# Altium schematic sheet BG1094_Connector.SchDoc: =project_title
size Tabloid; CompanyName: Luxonis Holding; Organization: Luxonis Holding; Address1: 1925 Harmony Park Drive; Address2: Westminster, CO; Address3: 80234; Address4: United States; SheetNumber: 3; SheetTotal: 5
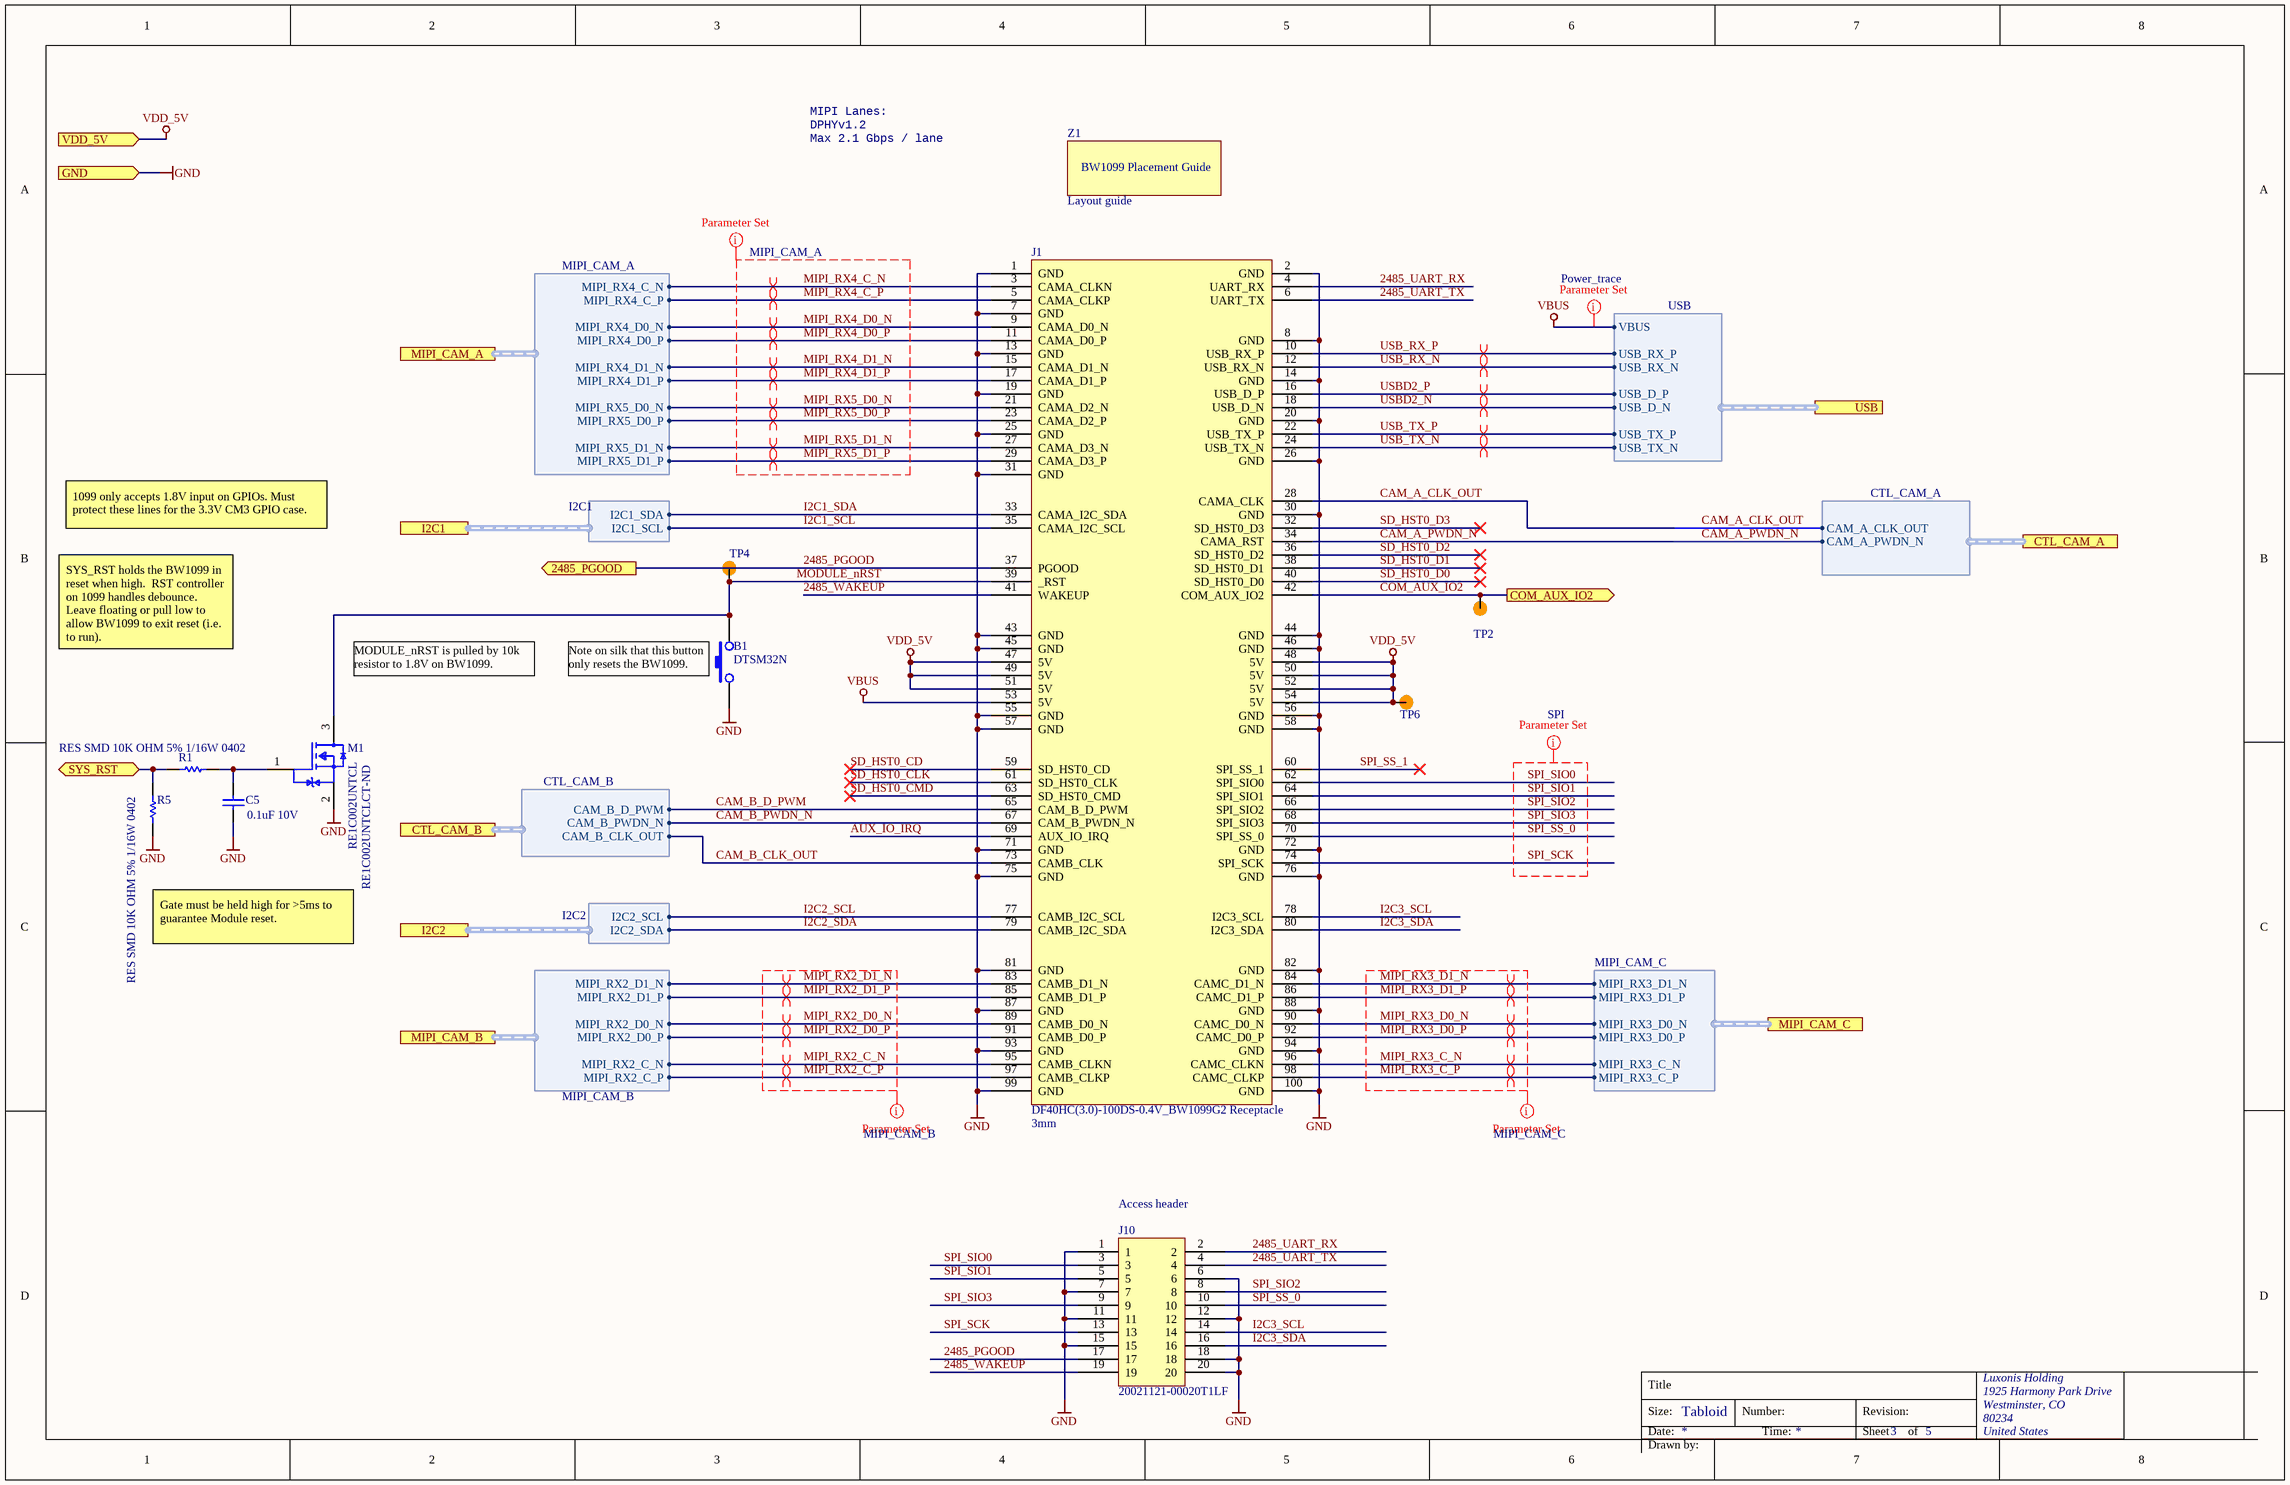
[diagram p0: BG1094_Connector.SchDoc]

## Parts
B1  DTSM32N  [DTSM32N]
C5  0.1uF 10V  [CAPC0402(1005)70_N]
J1  DF40HC(3.0)-100DS-0.4V_BW1099G2 Receptacle  Mated Stacking Height: 3mm  [DF40HC-3.0-100DS-0.4V_minpad]
J10  20021121-00020T1LF  [20021121-00020T1LF]
M1  RE1C002UNTCL  Supplier Part Number 1: RE1C002UNTCLCT-ND  [SOT-416FL]
R1  RES SMD 10K OHM 5% 1/16W 0402  [RESC0402(1005)_N]
R5  RES SMD 10K OHM 5% 1/16W 0402  [RESC0402(1005)_N]
TP2  TP100_200_NS  [TP100_200_NS]  (value not drawn)  (no BOM)
TP4  TP_SMD  [TP_0.75MM_SMD_NO-SILK]  (value not drawn)  (no BOM)
TP6  TP_SMD  [TP_0.75MM_SMD_NO-SILK]  (value not drawn)  (no BOM)
Z1  Layout guide  [BW1099_Footprint]  (no BOM)

## Ports
2485_PGOOD (out), COM_AUX_IO2 (out), CTL_CAM_A (harness CTL_CAM_A), CTL_CAM_B (harness CTL_CAM_B), GND (in), I2C1 (harness I2C1), I2C2 (harness I2C2), MIPI_CAM_A (harness MIPI_CAM_A), MIPI_CAM_B (harness MIPI_CAM_B), MIPI_CAM_C (harness MIPI_CAM_C), SYS_RST (bidir), USB (harness USB), VDD_5V (in)

## Harnesses
MIPI_CAM_B: MIPI_RX2_C_P, MIPI_RX2_C_N, MIPI_RX2_D0_P, MIPI_RX2_D0_N, MIPI_RX2_D1_P, MIPI_RX2_D1_N
MIPI_CAM_A: MIPI_RX4_C_P, MIPI_RX4_C_N, MIPI_RX4_D0_P, MIPI_RX4_D0_N, MIPI_RX4_D1_P, MIPI_RX4_D1_N, MIPI_RX5_D0_P, MIPI_RX5_D0_N, MIPI_RX5_D1_P, MIPI_RX5_D1_N
MIPI_CAM_C: MIPI_RX3_C_P, MIPI_RX3_C_N, MIPI_RX3_D0_P, MIPI_RX3_D0_N, MIPI_RX3_D1_P, MIPI_RX3_D1_N
I2C2: I2C2_SDA, I2C2_SCL
I2C1: I2C1_SDA, I2C1_SCL
USB: USB_D_P, USB_D_N, USB_TX_N, USB_TX_P, USB_RX_N, USB_RX_P, VBUS
CTL_CAM_A: CAM_A_PWDN_N, CAM_A_CLK_OUT
CTL_CAM_B: CAM_B_CLK_OUT, CAM_B_PWDN_N, CAM_B_D_PWM

## Nets
GND: B1.1 C5.1 J1.1(GND) J1.2(GND) J1.7(GND) J1.8(GND) J1.13(GND) J1.14(GND) J1.19(GND) J1.20(GND) J1.25(GND) J1.26(GND) J1.30(GND) J1.31(GND) J1.43(GND) J1.44(GND) J1.45(GND) J1.46(GND) J1.55(GND) J1.56(GND) J1.57(GND) J1.58(GND) J1.71(GND) J1.72(GND) J1.75(GND) J1.76(GND) J1.81(GND) J1.82(GND) J1.87(GND) J1.88(GND) J1.93(GND) J1.94(GND) J1.99(GND) J1.100(GND) J10.1 J10.6 J10.7 J10.11 J10.12 J10.15 J10.18 J10.20 M1.2(Source) R5.1 ; port GND
VBUS: J1.53(5V) ; port USB.VBUS
VDD_5V: J1.47(5V) J1.48(5V) J1.49(5V) J1.50(5V) J1.51(5V) J1.52(5V) J1.54(5V) TP6.1 ; port VDD_5V
2485_PGOOD: J1.37(PGOOD) J10.17 ; port 2485_PGOOD
2485_UART_RX: J1.4(UART_RX) J10.2
2485_UART_TX: J1.6(UART_TX) J10.4
2485_WAKEUP: J1.41(WAKEUP) J10.19
AUX_IO_IRQ: J1.69(AUX_IO_IRQ)
CAM_A_CLK_OUT: J1.28(CAMA_CLK) ; port CTL_CAM_A.CAM_A_CLK_OUT
CAM_A_PWDN_N: J1.34(CAMA_RST) ; port CTL_CAM_A.CAM_A_PWDN_N
CAM_B_CLK_OUT: J1.73(CAMB_CLK) ; port CTL_CAM_B.CAM_B_CLK_OUT
CAM_B_D_PWM: J1.65(CAM_B_D_PWM) ; port CTL_CAM_B.CAM_B_D_PWM
CAM_B_PWDN_N: J1.67(CAM_B_PWDN_N) ; port CTL_CAM_B.CAM_B_PWDN_N
COM_AUX_IO2: J1.42(COM_AUX_IO2) TP2.1 ; port COM_AUX_IO2
I2C1_SCL: J1.35(CAMA_I2C_SCL) ; port I2C1.I2C1_SCL
I2C1_SDA: J1.33(CAMA_I2C_SDA) ; port I2C1.I2C1_SDA
I2C2_SCL: J1.77(CAMB_I2C_SCL) ; port I2C2.I2C2_SCL
I2C2_SDA: J1.79(CAMB_I2C_SDA) ; port I2C2.I2C2_SDA
I2C3_SCL: J1.78(I2C3_SCL) J10.14
I2C3_SDA: J1.80(I2C3_SDA) J10.16
MIPI_RX2_C_N: J1.95(CAMB_CLKN) ; port MIPI_CAM_B.MIPI_RX2_C_N
MIPI_RX2_C_P: J1.97(CAMB_CLKP) ; port MIPI_CAM_B.MIPI_RX2_C_P
MIPI_RX2_D0_N: J1.89(CAMB_D0_N) ; port MIPI_CAM_B.MIPI_RX2_D0_N
MIPI_RX2_D0_P: J1.91(CAMB_D0_P) ; port MIPI_CAM_B.MIPI_RX2_D0_P
MIPI_RX2_D1_N: J1.83(CAMB_D1_N) ; port MIPI_CAM_B.MIPI_RX2_D1_N
MIPI_RX2_D1_P: J1.85(CAMB_D1_P) ; port MIPI_CAM_B.MIPI_RX2_D1_P
MIPI_RX3_C_N: J1.96(CAMC_CLKN) ; port MIPI_CAM_C.MIPI_RX3_C_N
MIPI_RX3_C_P: J1.98(CAMC_CLKP) ; port MIPI_CAM_C.MIPI_RX3_C_P
MIPI_RX3_D0_N: J1.90(CAMC_D0_N) ; port MIPI_CAM_C.MIPI_RX3_D0_N
MIPI_RX3_D0_P: J1.92(CAMC_D0_P) ; port MIPI_CAM_C.MIPI_RX3_D0_P
MIPI_RX3_D1_N: J1.84(CAMC_D1_N) ; port MIPI_CAM_C.MIPI_RX3_D1_N
MIPI_RX3_D1_P: J1.86(CAMC_D1_P) ; port MIPI_CAM_C.MIPI_RX3_D1_P
MIPI_RX4_C_N: J1.3(CAMA_CLKN) ; port MIPI_CAM_A.MIPI_RX4_C_N
MIPI_RX4_C_P: J1.5(CAMA_CLKP) ; port MIPI_CAM_A.MIPI_RX4_C_P
MIPI_RX4_D0_N: J1.9(CAMA_D0_N) ; port MIPI_CAM_A.MIPI_RX4_D0_N
MIPI_RX4_D0_P: J1.11(CAMA_D0_P) ; port MIPI_CAM_A.MIPI_RX4_D0_P
MIPI_RX4_D1_N: J1.15(CAMA_D1_N) ; port MIPI_CAM_A.MIPI_RX4_D1_N
MIPI_RX4_D1_P: J1.17(CAMA_D1_P) ; port MIPI_CAM_A.MIPI_RX4_D1_P
MIPI_RX5_D0_N: J1.21(CAMA_D2_N) ; port MIPI_CAM_A.MIPI_RX5_D0_N
MIPI_RX5_D0_P: J1.23(CAMA_D2_P) ; port MIPI_CAM_A.MIPI_RX5_D0_P
MIPI_RX5_D1_N: J1.27(CAMA_D3_N) ; port MIPI_CAM_A.MIPI_RX5_D1_N
MIPI_RX5_D1_P: J1.29(CAMA_D3_P) ; port MIPI_CAM_A.MIPI_RX5_D1_P
MODULE_nRST: B1.2 J1.39(_RST) M1.3(Drain) TP4.1
SD_HST0_CD: J1.59(SD_HST0_CD)
SD_HST0_CLK: J1.61(SD_HST0_CLK)
SD_HST0_CMD: J1.63(SD_HST0_CMD)
SD_HST0_D0: J1.40(SD_HST0_D0)
SD_HST0_D1: J1.38(SD_HST0_D1)
SD_HST0_D2: J1.36(SD_HST0_D2)
SD_HST0_D3: J1.32(SD_HST0_D3)
SPI_SCK: J1.74(SPI_SCK) J10.13
SPI_SIO0: J1.62(SPI_SIO0) J10.3
SPI_SIO1: J1.64(SPI_SIO1) J10.5
SPI_SIO2: J1.66(SPI_SIO2) J10.8
SPI_SIO3: J1.68(SPI_SIO3) J10.9
SPI_SS_0: J1.70(SPI_SS_0) J10.10
SPI_SS_1: J1.60(SPI_SS_1)
SYS_RST: R1.2 R5.2 ; port SYS_RST
USB_RX_N: J1.12(USB_RX_N) ; port USB.USB_RX_N
USB_RX_P: J1.10(USB_RX_P) ; port USB.USB_RX_P
USB_TX_N: J1.24(USB_TX_N) ; port USB.USB_TX_N
USB_TX_P: J1.22(USB_TX_P) ; port USB.USB_TX_P
USBD2_N: J1.18(USB_D_N) ; port USB.USB_D_N
USBD2_P: J1.16(USB_D_P) ; port USB.USB_D_P
NetC5_2: C5.2 M1.1(Gate) R1.1

## Layout directives
net class MIPI_CAM_C; rule Matched Net Lengths [Tolerance = 5mil]: MIPI_RX3_C_N, MIPI_RX3_C_P, MIPI_RX3_D0_N, MIPI_RX3_D0_P, MIPI_RX3_D1_N, MIPI_RX3_D1_P
net class MIPI_CAM_A; rule Matched Net Lengths [Tolerance = 5mil]: MIPI_RX4_C_N, MIPI_RX4_C_P, MIPI_RX4_D0_N, MIPI_RX4_D0_P, MIPI_RX4_D1_N, MIPI_RX4_D1_P, MIPI_RX5_D0_N, MIPI_RX5_D0_P, MIPI_RX5_D1_N, MIPI_RX5_D1_P
net class MIPI_CAM_B; rule Matched Net Lengths [Tolerance = 5mil]: MIPI_RX2_C_N, MIPI_RX2_C_P, MIPI_RX2_D0_N, MIPI_RX2_D0_P, MIPI_RX2_D1_N, MIPI_RX2_D1_P
differential pair; differential pair class 100ohm: MIPI_RX2_C_N, MIPI_RX2_C_P, MIPI_RX2_D0_N, MIPI_RX2_D0_P, MIPI_RX2_D1_N, MIPI_RX2_D1_P, MIPI_RX3_C_N, MIPI_RX3_C_P, MIPI_RX3_D0_N, MIPI_RX3_D0_P, MIPI_RX3_D1_N, MIPI_RX3_D1_P, MIPI_RX4_C_N, MIPI_RX4_C_P, MIPI_RX4_D0_N, MIPI_RX4_D0_P, MIPI_RX4_D1_N, MIPI_RX4_D1_P, MIPI_RX5_D0_N, MIPI_RX5_D0_P, MIPI_RX5_D1_N, MIPI_RX5_D1_P
differential pair; differential pair class 90ohm: USB_RX_N, USB_RX_P, USB_TX_N, USB_TX_P, USBD2_N, USBD2_P
net class Power_trace: VBUS
net class SPI; rule Matched Net Lengths [Tolerance = 100mil]: SPI_SCK, SPI_SIO0, SPI_SIO1, SPI_SIO2, SPI_SIO3, SPI_SS_0

## Notes on the sheet
- MIPI Lanes:
- Max 2.1 Gbps / lane
- DPHYv1.2
- 1099 only accepts 1.8V input on GPIOs. Must protect these lines for the 3.3V CM3 GPIO case.
- SYS_RST holds the BW1099 in reset when high.  RST controller on 1099 handles debounce.  Leave floating or pull low to allow BW1099 to exit reset (i.e. to run).
- MODULE_nRST is pulled by 10k resistor to 1.8V on BW1099.
- (near B1) Note on silk that this button only resets the BW1099.
- Gate must be held high for >5ms to guarantee Module reset.
- (near J10) Access header
- Title
- Size:
- Date:
- Tabloid
- Number:
- Time:
- Revision:
- Sheet
- of
- Drawn by:
- (in symbol BW1099_Footprint) BW1099 Placement Guide

## Library data of the parts
B1 = SW-PB: Tact Switch; MAN: Wurth; MAN PN: 434 113 050 826; DIST: Farnell; DIST PN: 1868029; ICCO PN: M1V00020
C5 = !CAP: 0.1uF 10V X7R 10% Pad SMD 0402 125C T/R; Manufacturer 1: Murata; Manufacturer Part Number 1: GRM155R71A104KA01D; Capacitance: 100nF; Dissipation Factor: 0.035%; Supplier 1: Digi-Key; Supplier Part Number 1: 490-6321-1-ND; Stock 1: 6982387; Pricing 1: 1=0.10000, 10=0.03400, 100=0.01500, 500=0.01074, 1000=0.00844, 2500=0.00768, 5000=0.00706 (USD); RoHS: Yes; Mount: Surface Mount; Case/Package: 0402; Number of Pins: 2; Case Code (Metric): 1005; Case Code (Imperial): 0402; Min Operating Temperature: -55°C; Max Operating Temperature: 125°C; Voltage Rating: 10V; Tolerance: 10%; Packaging: Tape and Reel; Voltage Rating (DC): 10V; Dielectric: X7R; Package Quantity: 1; Termination: SMD/SMT; Voltage: 10V; Length: 1mm; Height: 0.5mm; Width: 0.02inch; Depth: 0.5mm; Thickness: 0.022inch; Radiation Hardening: No; REACH SVHC: No SVHC; Lead Free: Lead Free; ComponentLink1URL: https://datasheet.ciiva.com/18184/getdatasheetpartid-130330-18184636.pdf?src-supplier=Verical; ComponentLink1Description: https://datasheet.ciiva.com/18184/getdatasheetpartid-130330-18184636.pdf?src-supplier=Verical; ComponentLink2URL: https://datasheet.ciiva.com/7937/1747441-7937613.pdf?src-supplier=Element14; ComponentLink2Description: https://datasheet.ciiva.com/7937/1747441-7937613.pdf?src-supplier=Element14; ComponentLink3URL: https://datasheet.ciiva.com/6271/product-6271137.pdf?src-supplier=Digi-Key; ComponentLink3Description: https://datasheet.ciiva.com/6271/product-6271137.pdf?src-supplier=Digi-Key; ComponentLink4URL: https://datasheet.ciiva.com/11789/0900766b80ef921d-11789061.pdf?src-supplier=RSComponents; ComponentLink4Description: https://datasheet.ciiva.com/11789/0900766b80ef921d-11789061.pdf?src-supplier=RSComponents; ComponentLink5URL: https://datasheet.ciiva.com/19475/1856345-19475961.pdf?src-supplier=Jameco; ComponentLink5Description: https://datasheet.ciiva.com/19475/1856345-19475961.pdf?src-supplier=Jameco; ComponentLink6URL: https://datasheet.ciiva.com/16199/c02e-16199258.pdf?src-supplier=Future+Electronics; ComponentLink6Description: https://datasheet.ciiva.com/16199/c02e-16199258.pdf?src-supplier=Future+Electronics; ComponentLink7URL: https://datasheet.ciiva.com/6271/partnumbering-e-01-6271135.pdf?src-supplier=Digi-Key; ComponentLink7Description: https://datasheet.ciiva.com/6271/partnumbering-e-01-6271135.pdf?src-supplier=Digi-Key
J1 = DF40HC(3.0)-100DS-0.4V_BW1099_G2: CONN RCPT 100POS 0.4MM SMD GOLD; Manufacturer 1: Hirose; Manufacturer Part Number 1: DF40HC(3.0)-100DS-0.4V(51; Number of Positions: 100; Pitch: 0.016inch; RoHS: Yes; Mount: Surface Mount; Contact Plating: Gold; Packaging: Tape and Reel; Number of Rows: 2; Package Quantity: 1000; Connector Type: Receptacle; Lead Free: Lead Free; ComponentLink1URL: https://datasheet.ciiva.com/46636/ed-df40-20140305-46636517.pdf?src-supplier=Digi-Key; ComponentLink1Description: https://datasheet.ciiva.com/46636/ed-df40-20140305-46636517.pdf?src-supplier=Digi-Key; ComponentLink2URL: https://datasheet.ciiva.com/18562/ed-df40-20140305-18562189.pdf?src-supplier=Digi-Key; ComponentLink2Description: https://datasheet.ciiva.com/18562/ed-df40-20140305-18562189.pdf?src-supplier=Digi-Key; ComponentLink3URL: https://datasheet.ciiva.com/13559/ed-df40-20140305-13559540.pdf?src-supplier=Mouser; ComponentLink3Description: https://datasheet.ciiva.com/13559/ed-df40-20140305-13559540.pdf?src-supplier=Mouser; ComponentLink4URL: https://datasheet.ciiva.com/18562/ed-df40-20140305-18562462.pdf?src-supplier=Digi-Key; ComponentLink4Description: https://datasheet.ciiva.com/18562/ed-df40-20140305-18562462.pdf?src-supplier=Digi-Key; Supplier 1: Mouser; Stock 1: 2172; Pricing 1: 1=2.54000, 10=2.26000, 25=2.07000, 50=2.07000, 100=1.98000, 250=1.79000, 500=1.65000, 1000=1.41000, 3000=1.32000, 6000=1.23000, 10000=1.23000 (USD); Supplier 2: Mouser; Manufacturer 2: Hirose; Manufacturer Part Number 2: DF40HC(3.0)-100DS-0.4V(58); Stock 2: 2078; Pricing 2: 1=2.50000, 10=2.40000, 25=2.10000, 50=2.10000, 100=2.00000, 250=1.76000, 500=1.71000, 1000=1.45000, 2000=1.36000, 5000=1.31000, 10000=1.31000 (USD); Supplier Part Number 1: 798-DF40HC30100DS451; Supplier Part Number 2: 798-DF40HC30100DS458
J10 = 20021121-00020T1LF: Conn Unshrouded Header HDR 20 POS 1.27mm Solder ST SMD Tube; Manufacturer 1: Amphenol FCI; Contact Resistance: 30mR; Number of Positions: 20; Max Voltage Rating (AC): 125V; Connector Type: Male Pin; Row Spacing: 0.05inch; Supplier 1: Avnet; Manufacturer Part Number 1: 20021121-00020T1LF; Stock 1: 0; Pricing 1: 1840=0.65487, 3680=0.63909, 7360=0.62487, 11040=0.61127, 18400=0.60354 (USD); RoHS: Yes; Mount: Surface Mount; Contact Plating: Gold; Contact Material: Copper Alloy; Color: Black; Housing Color: Black; Housing Material: Thermoplastic; Min Operating Temperature: -40°C; Max Operating Temperature: 85°C; Packaging: Rail/Tube; Package Quantity: 46; Number of Rows: 2; Termination: Solder; Number of Contacts: 20; Orientation: Straight; Length: 12.7mm; Pitch: 1.27mm; Contact Mating Length: 0.12inch; Depth: 3.4mm; ComponentLink1URL: https://datasheet.ciiva.com/18660/20021121-18660311.pdf?src-supplier=Digi-Key; ComponentLink1Description: https://datasheet.ciiva.com/18660/20021121-18660311.pdf?src-supplier=Digi-Key; ComponentLink2URL: https://datasheet.ciiva.com/10033/20021121-10033355.pdf?src-supplier=Avnet; ComponentLink2Description: https://datasheet.ciiva.com/10033/20021121-10033355.pdf?src-supplier=Avnet; Supplier Part Number 1: 20021121-00020T1LF
M1 = RE1C002UNTCL: MOSFET N-CH 20V 0.2A EMT3; Manufacturer 1: Rohm; Continuous Drain Current (ID): 200mA; Rds On Max: 1.2R; Input Capacitance: 25pF; Max Power Dissipation: 150mW; Supplier 1: Digi-Key; Manufacturer Part Number 1: RE1C002UNTCL; Stock 1: 941425; Pricing 1: 1=0.20000, 10=0.18200, 100=0.09930, 500=0.06112, 1000=0.04167 (USD); RoHS: Yes; Mount: Surface Mount; Case/Package: SOT-89; Packaging: Tape and Reel; Drain to Source Voltage (Vdss): 20V; Lead Free: Lead Free; ComponentLink1URL: http://www.mouser.com/ds/2/348/re1c002untcl-e-1018231.pdf?src-supplier=Mouser; ComponentLink1Description: http://www.mouser.com/ds/2/348/re1c002untcl-e-1018231.pdf?src-supplier=Mouser; ComponentLink2URL: http://rohmfs.rohm.com/en/techdata_basic/transistor/taping/EMT3_TL_taping.pdf?src-supplier=Digi-Key; ComponentLink2Description: http://rohmfs.rohm.com/en/techdata_basic/transistor/taping/EMT3_TL_taping.pdf?src-supplier=Digi-Key; ComponentLink3URL: http://rohmfs.rohm.com/en/products/databook/datasheet/discrete/transistor/mosfet/re1c002un.pdf?src-supplier=Avnet; ComponentLink3Description: http://rohmfs.rohm.com/en/products/databook/datasheet/discrete/transistor/mosfet/re1c002un.pdf?src-supplier=Avnet; ComponentLink4URL: https://www.rohm.com/datasheet/RE1C002UN/re1c002untcl-e?src-supplier=Digi-Key; ComponentLink4Description: https://www.rohm.com/datasheet/RE1C002UN/re1c002untcl-e?src-supplier=Digi-Key; ComponentLink5URL: http://www.farnell.com/datasheets/2704376.pdf?src-supplier=Newark; ComponentLink5Description: http://www.farnell.com/datasheets/2704376.pdf?src-supplier=Newark
R1 R5 = !RES
TP2 = TEST_POINT
TP4 TP6 = TP_SMD: circular pad test point, SMD
Z1 = BW1099_Footprint: Use for aligning BW1099 mount